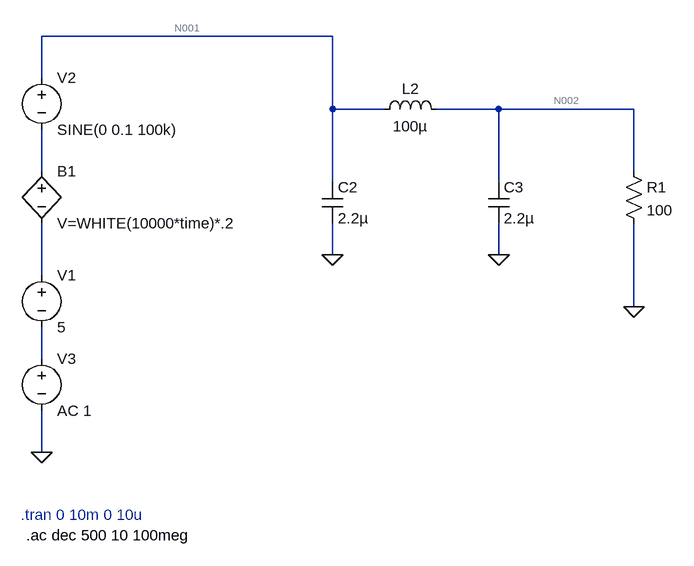
[diagram p0: schematic PiFilterSim.asc]
PiFilterSim.asc, the LTspice schematic file:
Version 4.1
SHEET 1 952 680
WIRE 416 -352 -32 -352
WIRE -32 -288 -32 -352
WIRE 416 -240 416 -352
WIRE 496 -240 416 -240
WIRE 672 -240 576 -240
WIRE 880 -240 672 -240
WIRE -32 -144 -32 -208
WIRE 880 -144 880 -240
WIRE 416 -128 416 -240
WIRE 672 -128 672 -240
WIRE 416 -16 416 -64
WIRE 672 -16 672 -64
WIRE -32 16 -32 -64
WIRE 880 64 880 -64
WIRE -32 144 -32 96
WIRE -32 288 -32 224
FLAG -32 288 0
FLAG 880 64 0
FLAG 416 -16 0
FLAG 672 -16 0
SYMBOL voltage -32 0 R0
WINDOW 123 0 0 Left 0
WINDOW 39 0 0 Left 0
SYMATTR InstName V1
SYMATTR Value 5
SYMBOL bv -32 -160 R0
SYMATTR InstName B1
SYMATTR Value V=WHITE(10000*time)*.2
SYMBOL ind 480 -224 R270
WINDOW 0 32 56 VTop 2
WINDOW 3 5 56 VBottom 2
SYMATTR InstName L2
SYMATTR Value 100µ
SYMATTR SpiceLine Ipk=1
SYMBOL res 864 -160 R0
SYMATTR InstName R1
SYMATTR Value 100
SYMBOL cap 400 -128 R0
SYMATTR InstName C2
SYMATTR Value 2.2µ
SYMBOL cap 656 -128 R0
SYMATTR InstName C3
SYMATTR Value 2.2µ
SYMBOL voltage -32 -304 R0
WINDOW 123 0 0 Left 0
WINDOW 39 0 0 Left 0
SYMATTR InstName V2
SYMATTR Value SINE(0 0.1 100k)
SYMBOL voltage -32 128 R0
WINDOW 123 0 0 Left 0
WINDOW 39 0 0 Left 0
SYMATTR InstName V3
SYMATTR Value AC 1
TEXT -64 384 Left 2 ;.tran 0 10m 0 10u
TEXT -56 416 Left 2 !.ac dec 500 10 100meg

The netlist it stands for:
* PiFilterSim.asc
V1 N004 N005 5
B1 N003 N004 V=WHITE(10000*time)*.2
L2 N001 N002 100µ Ipk=1
R1 N002 0 100
C2 N001 0 2.2µ
C3 N002 0 2.2µ
V2 N001 N003 SINE(0 0.1 100k)
V3 N005 0 AC 1
* .tran 0 10m 0 10u
.ac dec 500 10 100meg
.backanno
.end

* Results of the author's LTspice run, read from the files saved beside the schematic
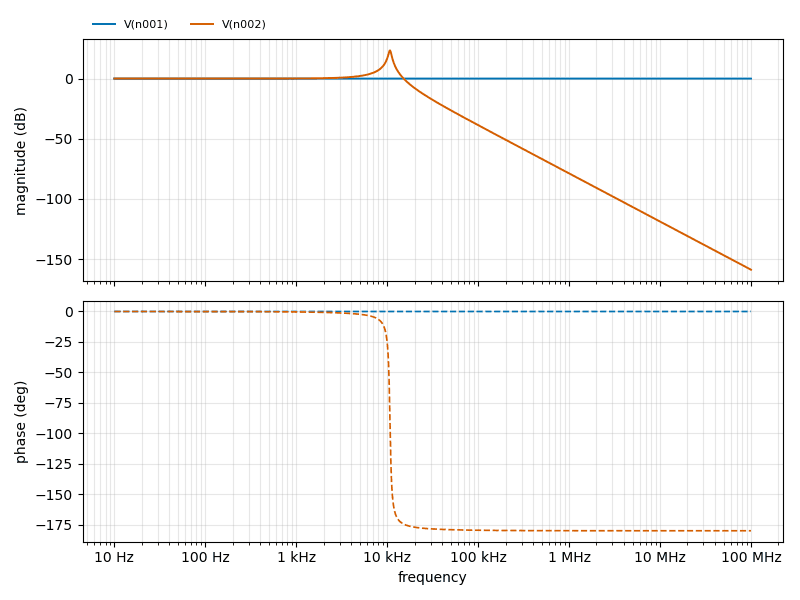
[diagram p1: AC Analysis of PiFilterSim.asc, plotted from the saved traces]
* AC Analysis, 1 run:
*   V(n001): 0.00 dB at 10 Hz, 0.00 dB at 100 MHz, peak 0.00 dB at 10 Hz
*   V(n002): -0.00 dB at 10 Hz, -158.78 dB at 100 MHz, peak 23.41 dB at 10.72 kHz, 3 dB below the peak at 10.35 kHz and 11.07 kHz